# EAGLE design backcover2bottom (EAGLE 7.6.0)
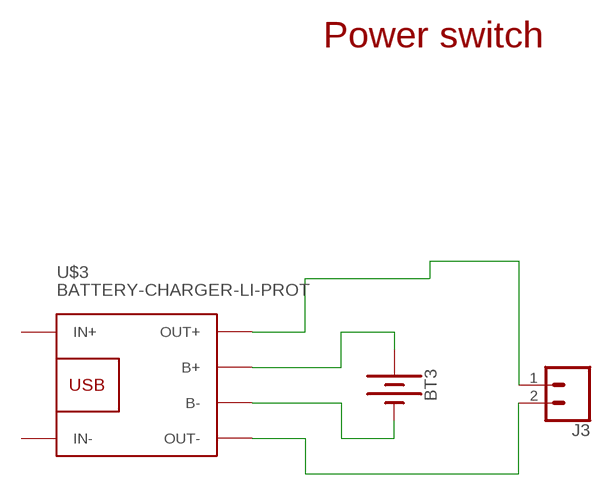
[diagram p0: schematic, sheet 1]

## Parts
BT3  BATTERY  [18650_HOLDER_SINGLE_THROUGH-HOLE]
J3  CONN_02PTH3  [1X02_LONGPADS]
U$3  BATTERY-CHARGER-LI-PROT  [BATTERY-CHARGER-LI-PROT]

## Nets
N$5: BT3.CON(+)(+) U$3.B+
N$6: BT3.CON(-)(-) U$3.B-
N$12: J3.2 U$3.OUT-
N$15: J3.1 U$3.OUT+
Unconnected: U$3.IN+ U$3.IN-

## Notes on the sheet
- Power switch

## Library data of the parts
BT3 = Batteries:BATTERY: Battery - Single Cell A variety of battery chemistries, sizes, and footprints. Device List: 20MM_PTH - Coin Cell Battery Holder - 20mm (PTH) <https://www.sparkfun.com/products/783> 12MM_SMD - Coin Cell Battery Holder - 12mm (SMD) <https://www.sparkfun.com/products/10592> 12MM_PTH - Coin Cell Battery Holder - 12mm (PTH) <https://www.sparkfun.com/products/7948> 20MM_SMD - 20mm Coin Cell Battery Holder (SMD) (2 legs) Used on the Big Time Watch Kit <https://www.sparkfun.com/products/11734> 20MM_SMD_4LEGS - Coin Cell Battery Holder - 20mm (SMD) <https://www.sparkfun.com/products/11892> 20MM_SMD_4LEGS_OVERPASTE - Coin Cell Battery Holder - 20mm (SMD) <https://www.sparkfun.com/products/11892> (Over-paste on the legs) 24.5MM_PTH - Coin Cell Battery Holder - 24.5mm (PTH) <https://www.sparkfun.com/products/8863> 9V - 9V Battery Holder - PC Mount Used on the SparkFun SparkPunk Sound Kit <https://www.sparkfun.com/products/11177> and SparkFun SparkPunk Sequencer Kit <https://www.sparkfun.com/products/12707> 18650 - Battery Holder - 18650 (PTH) <https://www.sparkfun.com/products/13113> AA - Battery Holder - 1xAA (PTH) <https://www.sparkfun.com/products/7949> AAA - Battery Holder - 1xAAA (PTH) <https://www.sparkfun.com/products/12718> AA_KIT - Battery Holder - 1xAA (PTH) <https://www.sparkfun.com/products/7949> Special kit package - pads only have exposed copper on one side of the board. AAA_KIT - Battery Holder - 1xAAA (PTH) <https://www.sparkfun.com/products/12718> Special kit package - pads only have exposed copper on one side of the board.
J3 = SparkFun-Connectors:CONN_02: Multi connection point. Often used as Generic Header-pin footprint for 0.1 inch spaced/style header connections On any of the 0.1 inch spaced packages, you can populate with these: Break Away Headers - Straight <https://www.sparkfun.com/products/116> (PRT-00116) Break Away Male Headers - Right Angle <https://www.sparkfun.com/products/553> (PRT-00553) Female Headers <https://www.sparkfun.com/products/115> (PRT-00115) Break Away Headers - Machine Pin <https://www.sparkfun.com/products/117> (PRT-00117) Break Away Female Headers - Swiss Machine Pin <https://www.sparkfun.com/products/743> (PRT-00743) For SCREWTERMINALS and SPRING TERMINALS visit here: Screw Terimnals on SparkFun.com <https://www.sparkfun.com/search/results?term=Screw+Terminals> (5mm/3.5mm/2.54mm spacing) This device is also useful as a general connection point to wire up your design to another part of your project. Our various solder wires solder well into these plated through hole pads. Hook-Up Wire - Assortment (Stranded, 22 AWG) <https://www.sparkfun.com/products/11375> (PRT-11375) Hook-Up Wire - Assortment (Solid Core, 22 AWG) <https://www.sparkfun.com/products/11367> (PRT-11367) View the entire wire category on our website here <https://www.sparkfun.com/categories/141> Special notes: Molex polarized connector foot print use with: PRT-08233 with associated crimp pins and housings. 2.54_SCREWTERM for use with PRT-10571. 3.5mm Screw Terminal footprints for PRT-08084 5mm Screw Terminal footprints for use with PRT-08432
U$3 = diy-modules:BATTERY-CHARGER-LI-PROT: Lithium Battery 5V Charger with protection circuit More details available here: http://www.instructables.com/id/DIY-Lithium-ion-Battery-Charger/step4/TP4056-based-lithium-ion-battery-charger-module/ Click here to find device on ebay.com <http://www.ebay.com/sch/tp4056+charger+usb+protection>

## Net classes
0 vcc: width 0.203 mm, drill 0.356 mm, clearance 0.254 mm
1 gnd: width 0.203 mm, drill 0.356 mm, clearance 0.254 mm
2 xxx: width 0.203 mm, drill 0.356 mm, clearance 0.254 mm

## Board
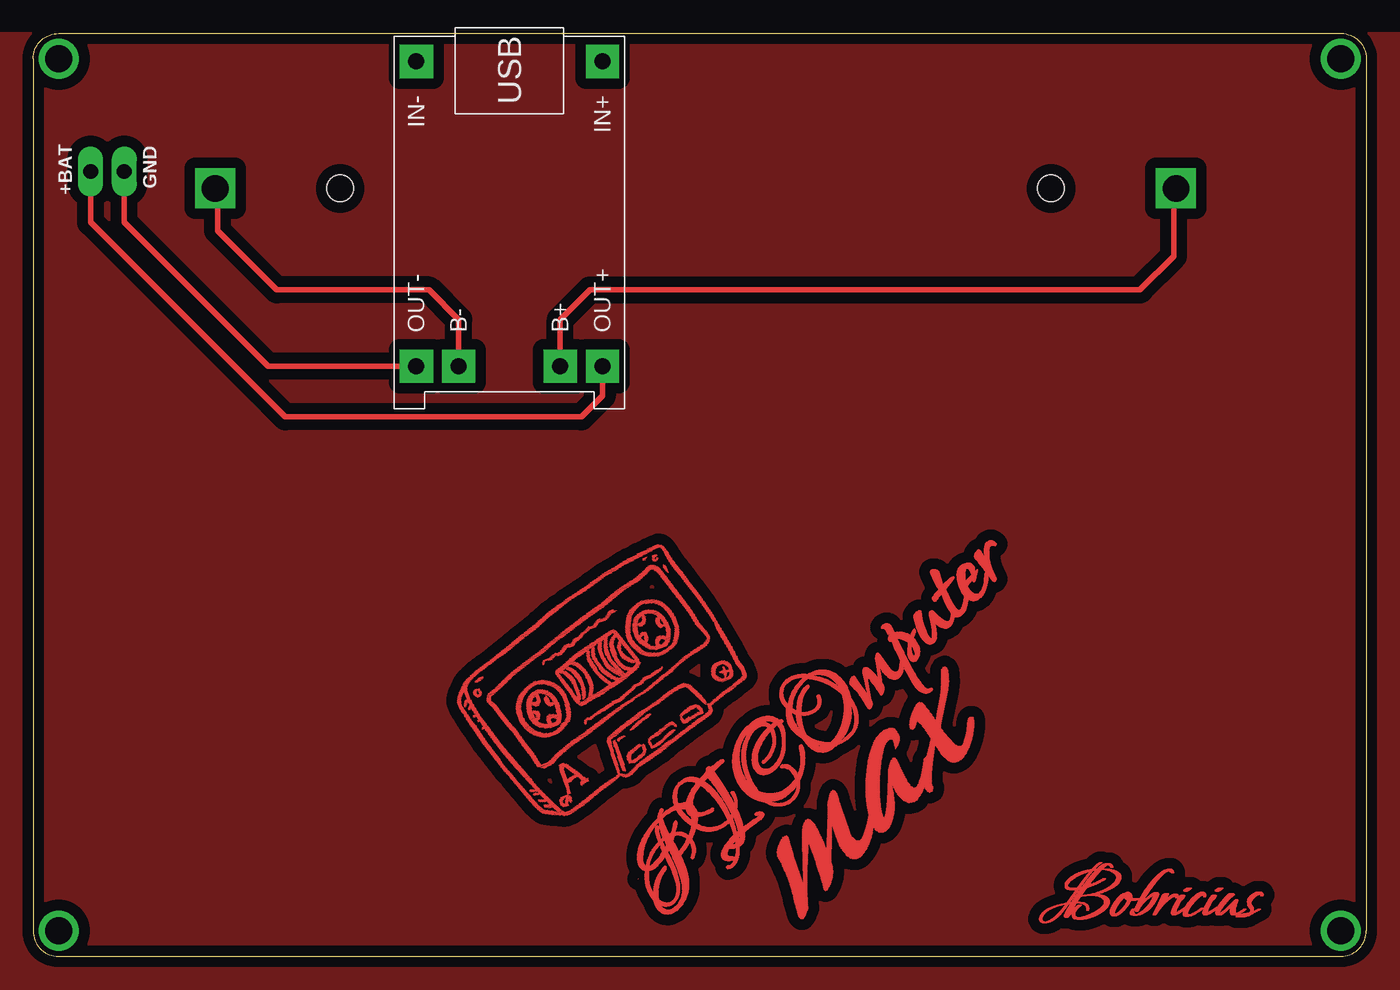
[diagram p1: board, top side]
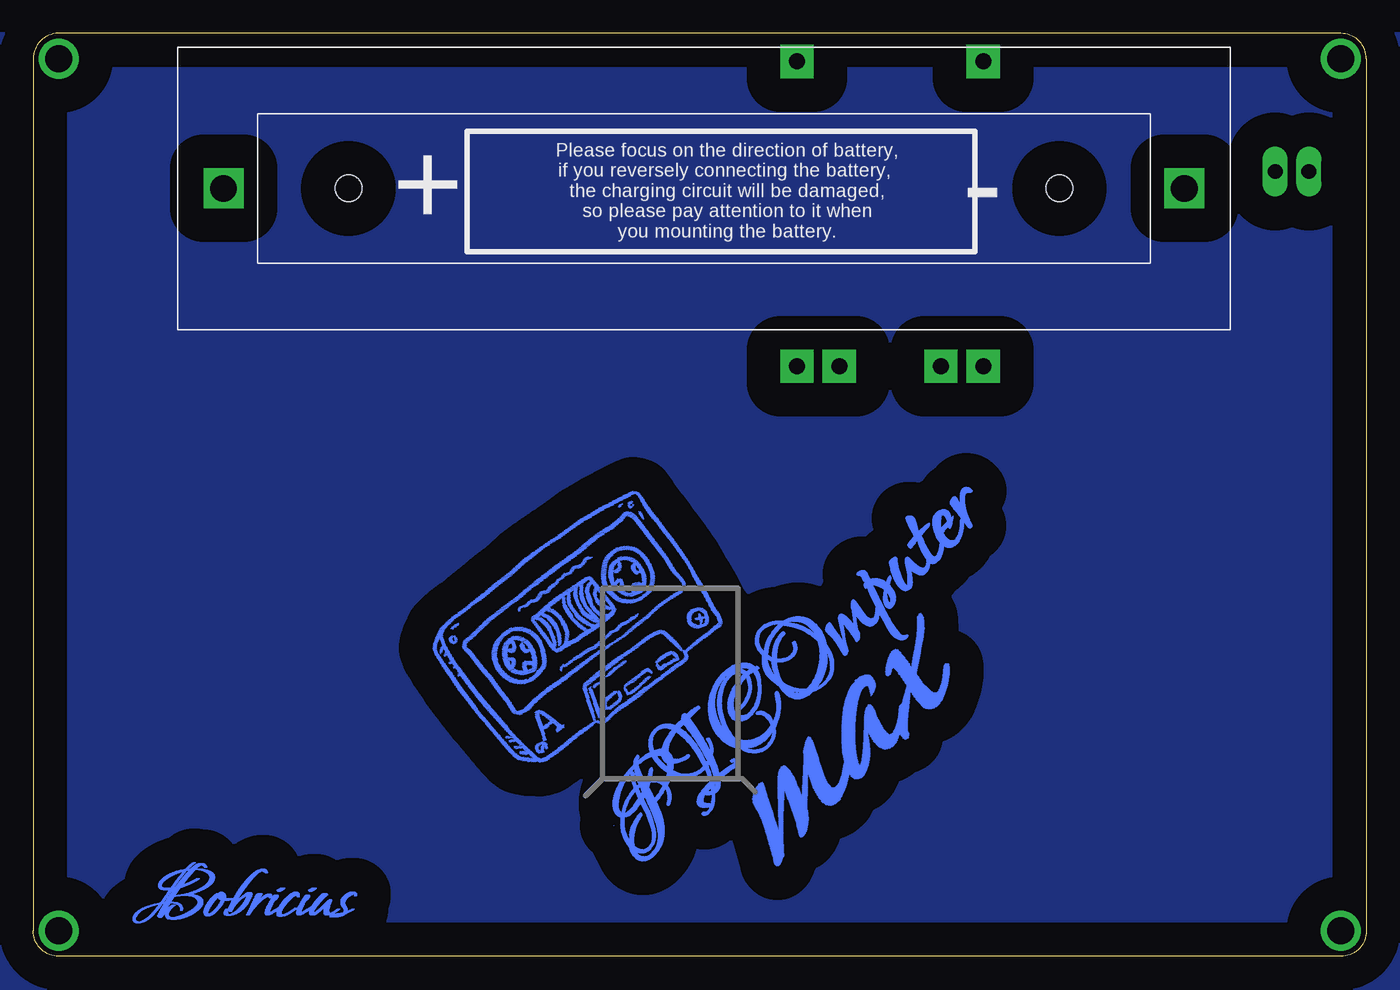
[diagram p2: board, bottom side, seen from below]

Size 100.01 x 69.22 mm. Coordinates in mm from the lower left corner, seen from the top.
Outline: 1.91,0 98.11,0 arc91 100.01,1.91 100.01,67.31 arc95 97.95,69.22 1.91,69.22 arc91 0,67.31 0,1.91 arc95 1.91,0
Copper layers (1*16): Top 0.0356mm / dielectric 1.5011mm / Bottom 0.0356mm
Design rules "LaenPCBOrder *": minimum track width 6mil, minimum drill 13mil, track to track 6mil, track to pad 6mil, pad to pad 6mil, via to via 6mil, smd to smd 6mil, copper to edge 15mil, drill to drill 6mil, minimum pad ring 7mil, minimum via ring 7mil, stop-mask expansion 4mil, vias tented up to drill 30mil, thermal gap 10mil

### Footprints (pad centres in the part's own frame; a part is rotated, then mirrored left to right if it is on the bottom)
18650_HOLDER_SINGLE_THROUGH-HOLE = drill 2 square: CON(+) -36.05,0; CON(-) 36.05,0 | hole 2: 26.67,0; -26.67,0
1X02_LONGPADS = drill 1.118 pad 1.88 long: 1 0,0; 2 2.54,0
BATTERY-CHARGER-LI-PROT = drill 1.2 pad 2.5 square: B+ 10.795,3.81; B- 10.795,-3.81; IN+ -12.065,6.985; IN- -12.065,-6.985; OUT+ 10.795,6.985; OUT- 10.795,-6.985

### Placement (x,y rotation side)
BT3  49.7,57.59 0 bottom
J3  4.29,58.86 0 top
U$3  35.73,55.05 270 top

### Tracks (layer width: path | path; a pad name or v marks a point on that pad's centre or on a via)
N$5
  Top 0.406: U$3.B+ 39.53,47.75 41.76,49.97 83.03,49.97 85.57,52.51 85.57,57.42 BT3.CON(+)
N$6
  Top 0.406: U$3.B- 31.92,47.75 29.69,49.97 18.26,49.97 13.82,54.42 13.82,57.42 BT3.CON(-)
N$9  (via drill 2)
  other vias: 98.11,1.91
N$12
  Top 0.406: U$3.OUT- 17.63,44.25 6.83,55.05 J3.2
N$14  (via drill 2)
  other vias: 1.91,67.31
N$15
  Top 0.406: U$3.OUT+ 42.71,42.03 41.12,40.44 18.9,40.44 4.29,55.05 J3.1
N$16
  pour Top (isolate 0.813): -3.49,69.22 -3.49,-4.45 103.19,-4.45 103.19,69.22
  pour Bottom (isolate 2.54): 103.19,69.22 103.19,-4.45 -3.49,-4.45 -3.49,69.22
N$22  (via drill 2)
  other vias: 98.11,67.31
N$23  (via drill 2)
  other vias: 1.91,1.91
(copper drawn outside any net)
  shapes: Bottom area x10124, Top area x10124

### Text on the board
tNames: +BAT | GND
bNames: Please focus on the direction of battery, / if you reversely connecting the battery, / the charging circuit will be damaged, / so please pay attention to it when / you mounting the battery.